# EAGLE design K3NG Rotator Interface V2 (EAGLE 9.6.2)
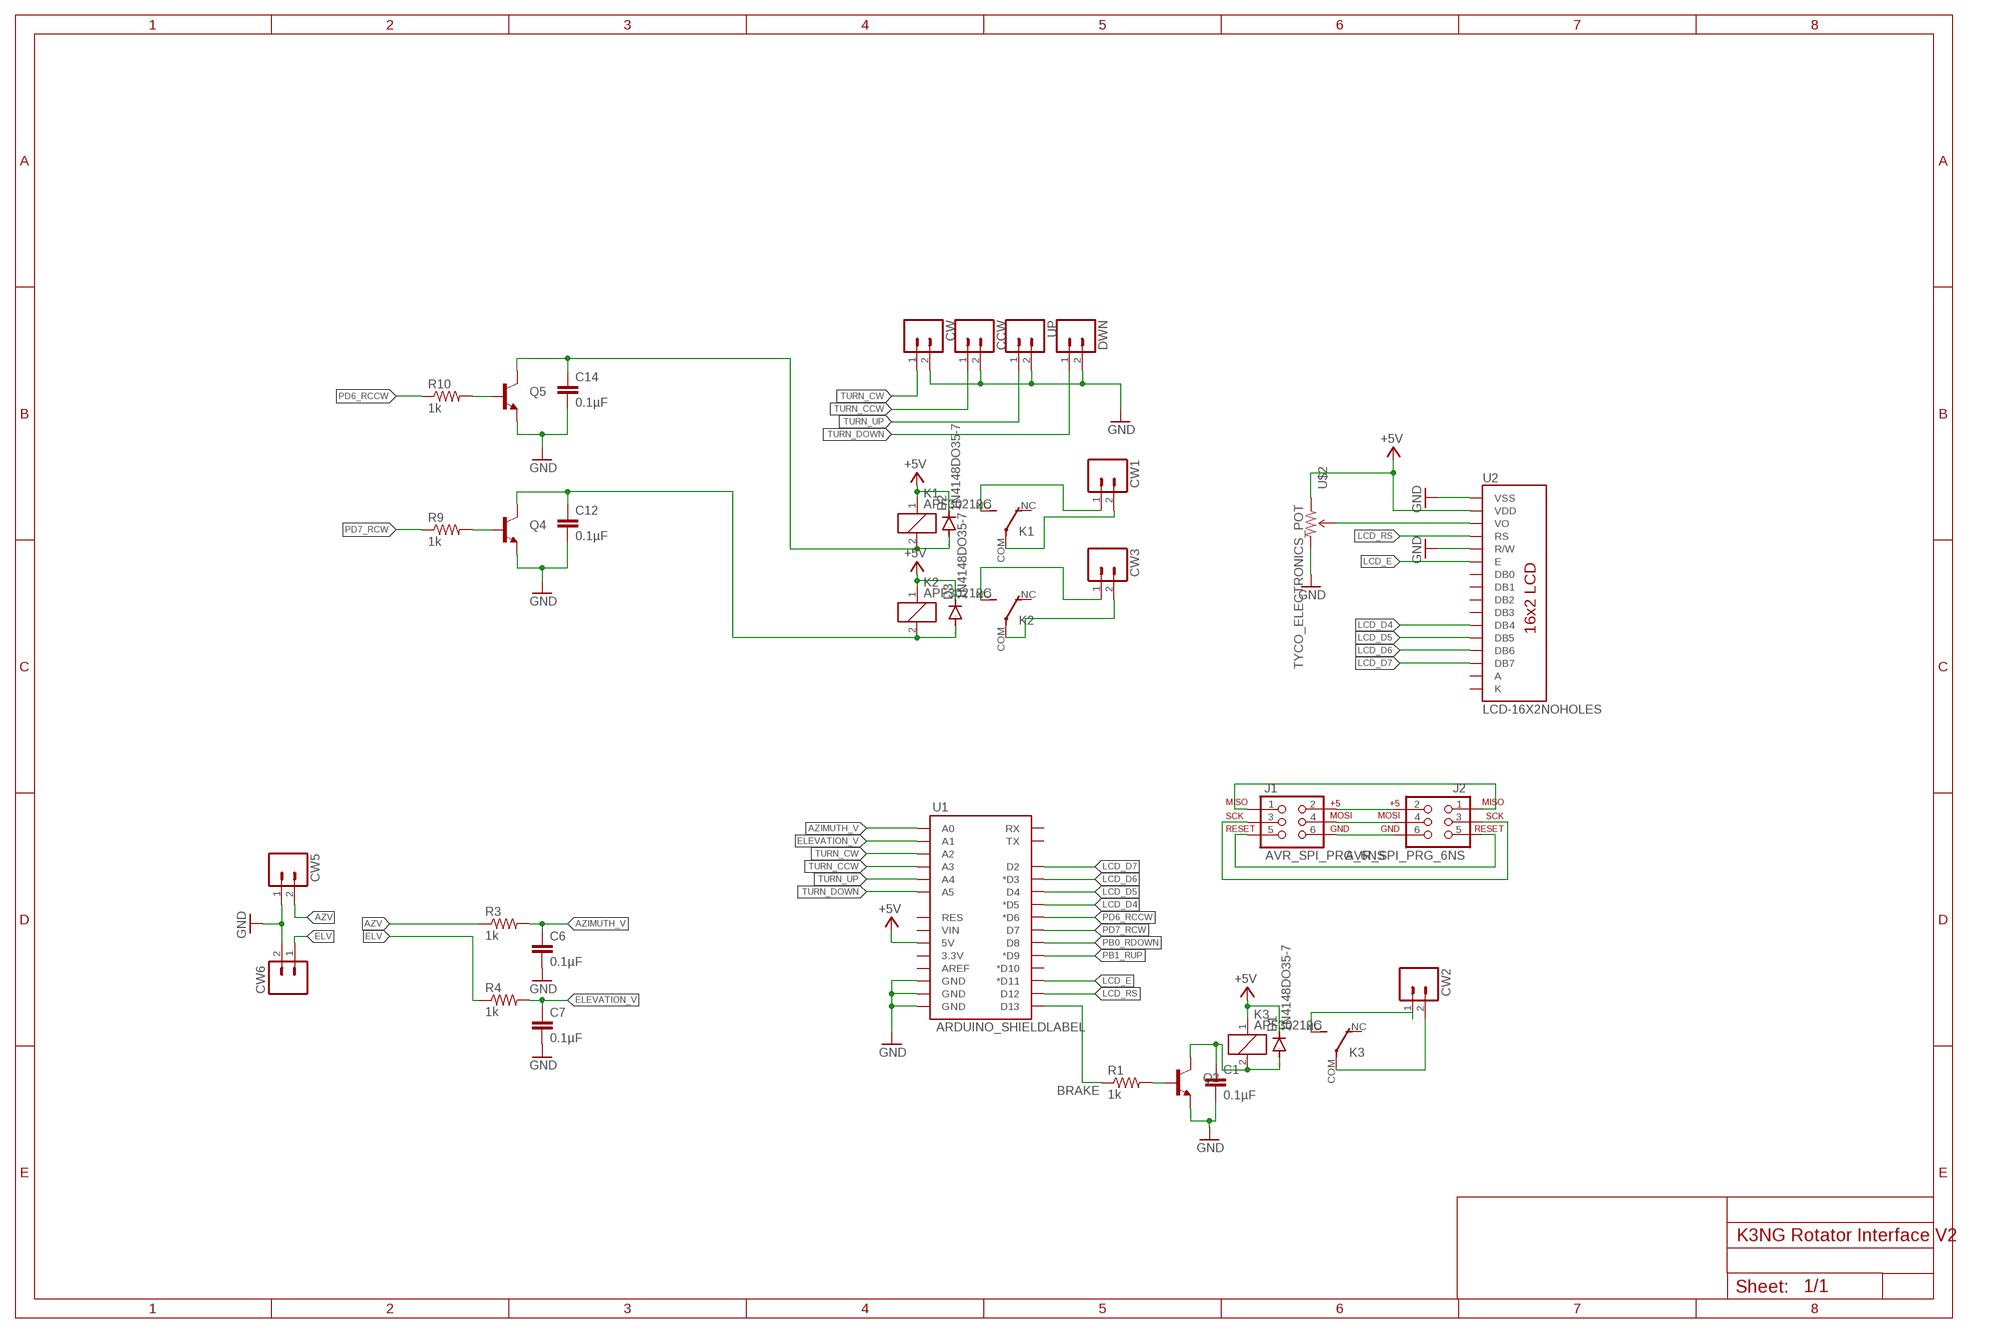
[diagram p0: schematic, sheet 1]

## Parts
C1  0.1µF  CAP0603-CAP  [0603-CAP]
C6  0.1µF  CAP0603-CAP  [0603-CAP]
C7  0.1µF  CAP0603-CAP  [0603-CAP]
C12  0.1µF  CAP0603-CAP  [0603-CAP]
C14  0.1µF  CAP0603-CAP  [0603-CAP]
CCW  M02PTH  [1X02]
CW  M02PTH  [1X02]
CW1  M02PTH  [1X02]
CW2  M02PTH  [1X02]
CW3  M02PTH  [1X02]
CW5  M02PTH  [1X02]
CW6  M02PTH  [1X02]
D1  1N4148DO35-7  [DO35-7]
D2  1N4148DO35-7  [DO35-7]
D3  1N4148DO35-7  [DO35-7]
DWN  M02PTH  [1X02]
J1  AVR_SPI_PRG_6NS  [2X3-NS]
J2  AVR_SPI_PRG_6NS  [2X3-NS]
K1  APF30212C  [APF30212C]
K2  APF30212C  [APF30212C]
K3  APF30212C  [APF30212C]
Q2  TRANSISTOR_NPNSOT23  [SOT23]
Q4  TRANSISTOR_NPNSOT23  [SOT23]
Q5  TRANSISTOR_NPNSOT23  [SOT23]
R1  1k  RESISTOR0805-RES  [0805]
R3  1k  RESISTOR0805-RES  [0805]
R4  1k  RESISTOR0805-RES  [0805]
R9  1k  RESISTOR0805-RES  [0805]
R10  1k  RESISTOR0805-RES  [0805]
U1  ARDUINO_SHIELDLABEL  [DUEMILANOVE_SHIELD]
U2  LCD-16X2NOHOLES  [LCD-16X2_NOHOLES]
U$2  TYCO_ELECTRONICS_POT  [TYCO_ELECTRONICS_POT]
UP  M02PTH  [1X02]

## Nets
+5V [usbvcc]: D1.C D2.C D3.C K1.1 K2.1 K3.1 U1.5V U2.2(VDD) U$2.P$1(CCW)
AZIMUTH_V: C6.1 R3.2 U1.A0
AZV: CW5.2 R3.1
BRAKE: R1.1 U1.D13
ELEVATION_V: C7.1 R4.2 U1.A1
ELV: CW6.1 R4.1
GND [gnd]: C1.2 C6.2 C7.2 C12.2 C14.2 CCW.2 CW5.1 CW6.2 CW.2 DWN.2 Q2.2(E) Q4.2(E) Q5.2(E) U1.GND@0(GND) U1.GND@1(GND) U1.GND@2(GND) U2.1(VSS) U2.5(R/W) U$2.P$3(CW) UP.2
LCD_D4: U1.D5(*D5) U2.11(DB4)
LCD_D5: U1.D4 U2.12(DB5)
LCD_D6: U1.D3(*D3) U2.13(DB6)
LCD_D7: U1.D2 U2.14(DB7)
LCD_E: U1.D11(*D11) U2.6(E)
LCD_RS: U1.D12 U2.4(RS)
N$1: J1.2 J2.2
N$2: J1.4 J2.4
N$3: J1.6 J2.6
N$4: J1.1 J2.1
N$5: J1.5 J2.5
N$6: J1.3 J2.3
N$7: CW2.2 K3.COM(2:P)
N$10: CW2.1 K3.NO(2:S)
N$11: CW1.1 K1.NO(2:S)
N$13: CW3.1 K2.NO(2:S)
N$15: Q2.1(B) R1.2
N$17: U2.3(VO) U$2.P$2(WIPER)
N$18: C1.1 D1.A K3.2 Q2.3(C)
N$19: Q4.1(B) R9.2
N$21: CW3.2 K2.COM(2:P)
N$22: Q5.1(B) R10.2
N$23: CW1.2 K1.COM(2:P)
PB0_RDOWN: U1.D8
PB1_RUP: U1.D9(*D9)
PD6_RCCW: R10.1 U1.D6(*D6)
PD7_RCW: R9.1 U1.D7
ROTATE_CCW: C14.1 D2.A K1.2 Q5.3(C)
ROTATE_CW: C12.1 D3.A K2.2 Q4.3(C)
TURN_CCW: CCW.1 U1.A3
TURN_CW: CW.1 U1.A2
TURN_DOWN: DWN.1 U1.A5
TURN_UP: U1.A4 UP.1
Unconnected: K1.NC(2:O) K2.NC(2:O) K3.NC(2:O) U1.3.3V U1.AREF U1.D10(*D10) U1.RES U1.RX U1.TX U1.VIN U2.7(DB0) U2.8(DB1) U2.9(DB2) U2.10(DB3)

## Power pins joined to a net without a drawn wire
A: U2.15(A)
K: U2.16(K)

## Library data of the parts
C1 C6 C7 C12 C14 = SparkFun:CAP: Capacitor Standard 0603 ceramic capacitor, and 0.1" leaded capacitor.
CCW CW CW1-CW3 CW5 CW6 DWN UP = SparkFun:M02: Header 2 Standard 2-pin 0.1" header. Use with straight break away headers (SKU : PRT-00116), right angle break away headers (PRT-00553), swiss pins (PRT-00743), machine pins (PRT-00117), and female headers (PRT-00115). Molex polarized connector foot print use with SKU : PRT-08233 with associated crimp pins and housings.
D1-D3 = diode:1N4148: DIODE high speed (Philips)
J1 J2 = SparkFun:AVR_SPI_PRG_6: AVR ISP 6 Pin This is the reduced ISP connector for AVR programming. Common on Arduino. This footprint will take up less PCB space and can be used with a 10-pin to 6-pin adapter such as SKU: BOB-08508
K1-K3 = relay:APF30212C: Compliant with European standards 1a/1c 6A Slim power relays Source: Data sheet <http://pewa.panasonic.com/assets/pcsd/catalog/pf-catalog.pdf>; OC_FARNELL: unknown
Q2 Q4 Q5 = SparkFun:TRANSISTOR_NPN: Transistor NPN BJT configuration in SOT23 package. MMBT2222 is the common NPN we use. Double check BCE configuration again layout.
R1 R3 R4 R9 R10 = SparkFun:RESISTOR: Resistor Basic schematic elements and footprints for 0603, 1206, and PTH resistors.
U1 = SparkFun:ARDUINO_SHIELD
U2 = SparkFun:LCD-16X2
U$2 = Ava:TYCO_ELECTRONICS_POT

## Net classes
0 default: width 0.254 mm, drill 0.305 mm, clearance 0.152 mm
2 gnd: width 0.305 mm, drill 0.508 mm, clearance 0.152 mm
3 usbvcc: width 0.508 mm, drill 0.508 mm, clearance 0.152 mm
4 aref: width 0.406 mm

## Board
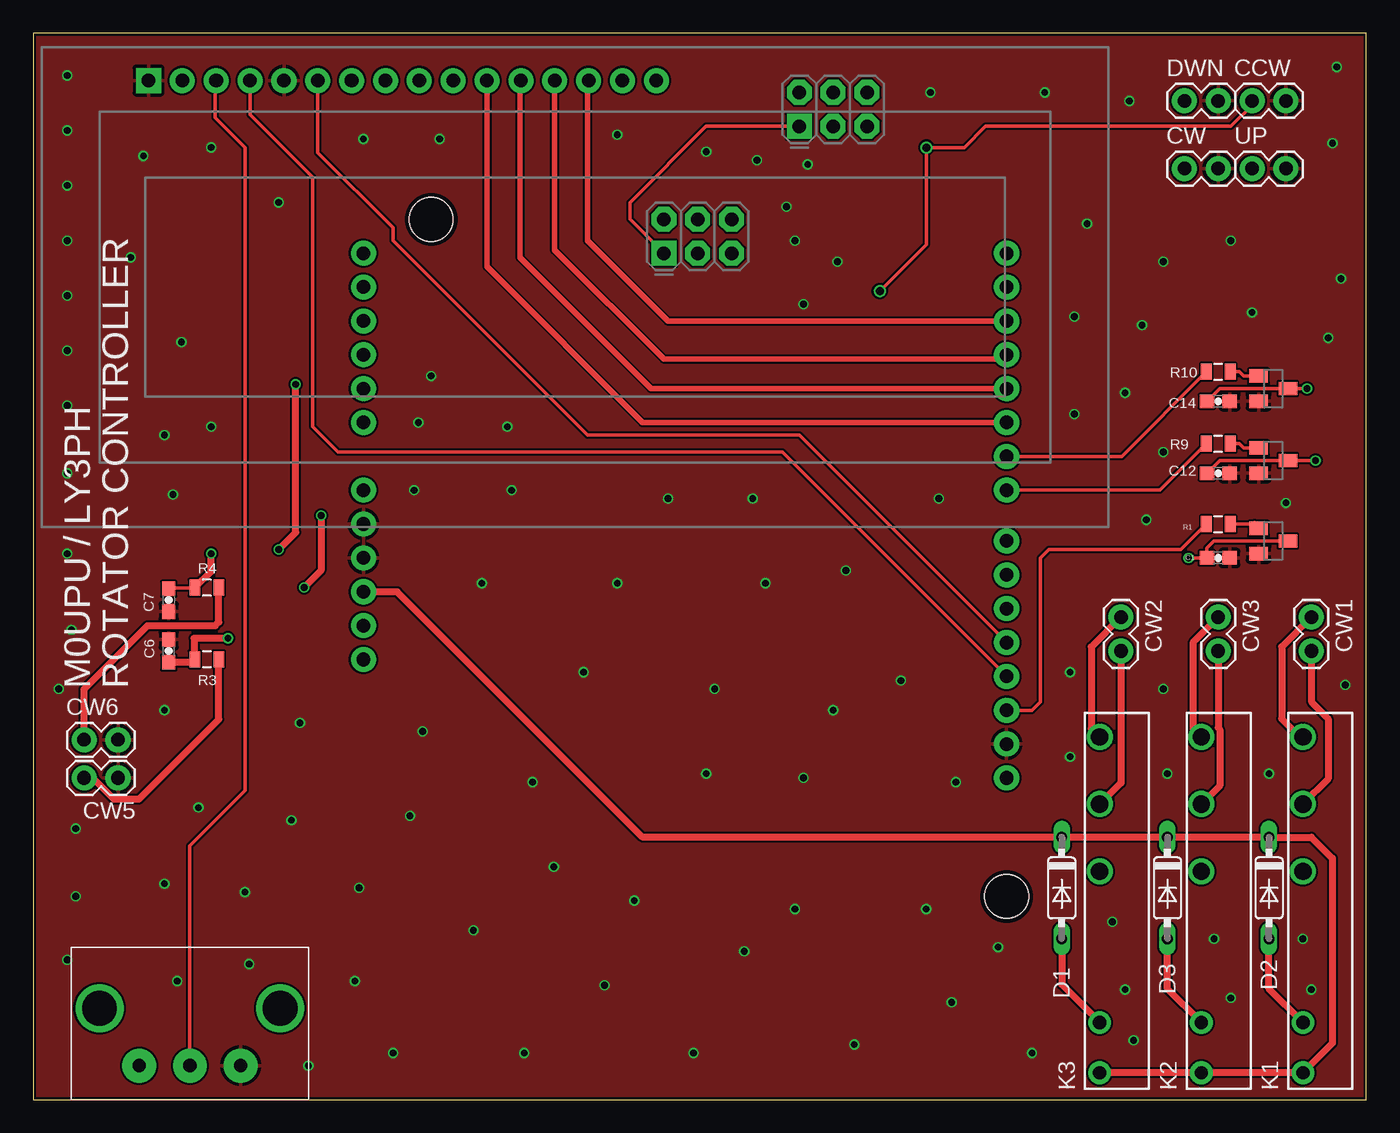
[diagram p1: board, top side]
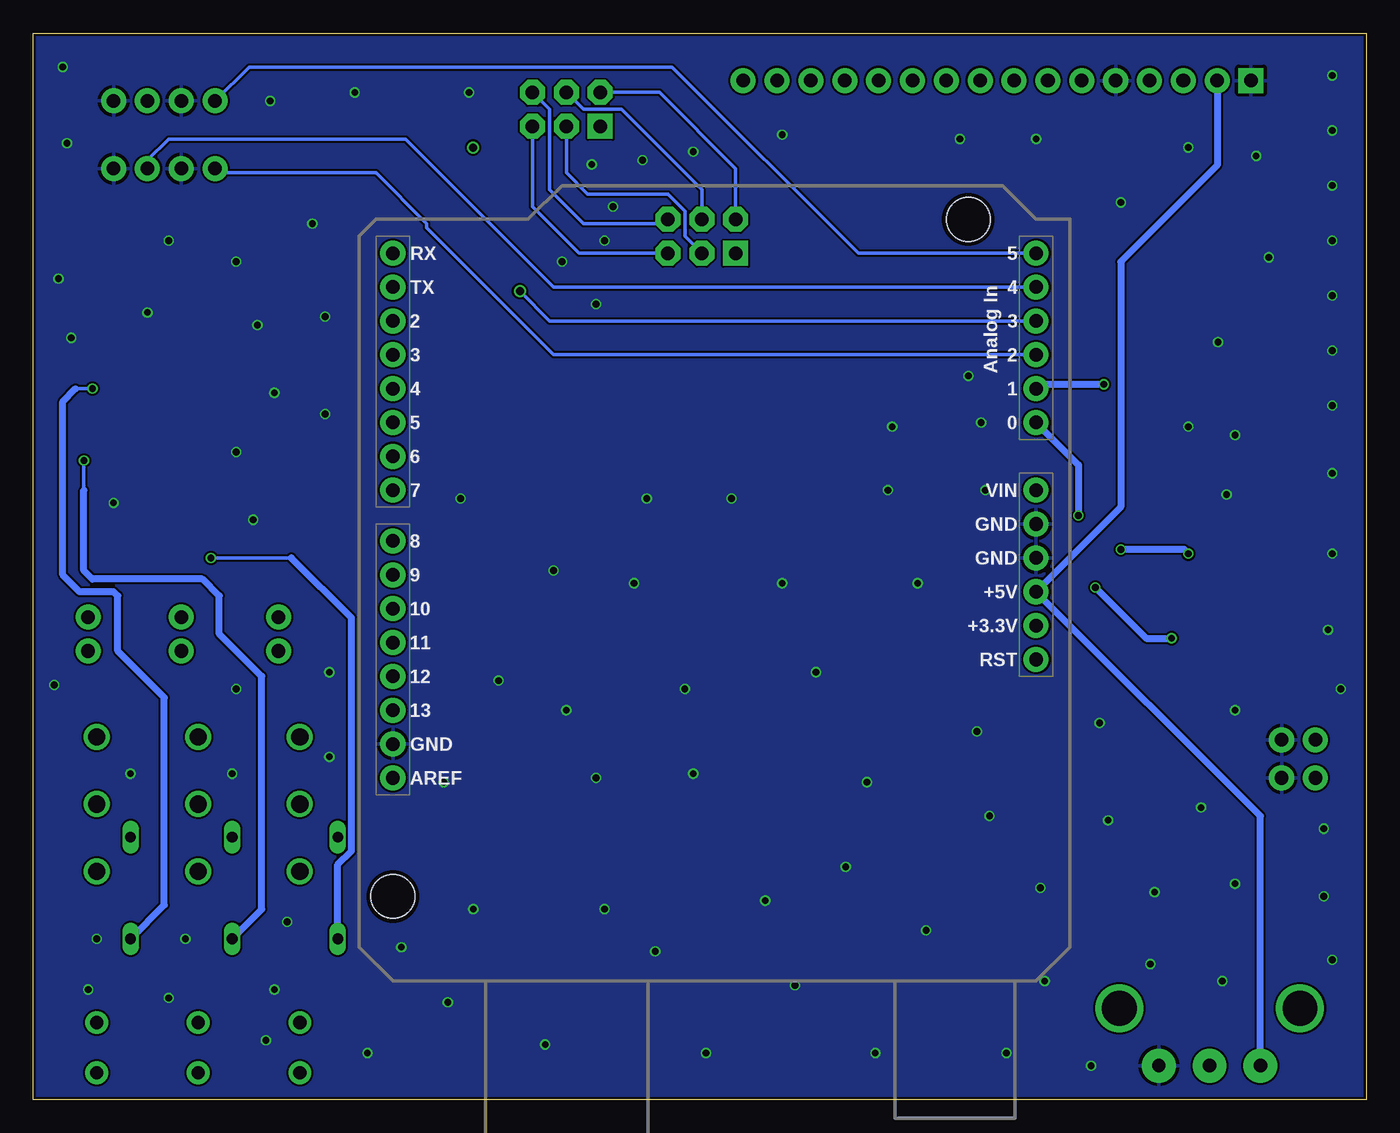
[diagram p2: board, bottom side, seen from below]

Size 100 x 80 mm. Coordinates in mm from the lower left corner, seen from the top.
Outline: 0,0 100,0 100,80 0,80 0,0
Copper layers (1*16): Top 0.035559375mm / dielectric 1.6mm / Bottom 0.035559375mm
Design rules "jlcpcb-2layers *": minimum track width 5mil, minimum drill 12mil, track to track 5mil, track to pad 5mil, pad to pad 5mil, via to via 5mil, smd to smd 5mil, copper to edge 8mil, drill to drill 6mil, minimum pad ring 5mil, minimum via ring 3mil, stop-mask expansion 2.5mil, vias tented up to drill 15mil, thermal gap 10mil

### Footprints (pad centres in the part's own frame; a part is rotated, then mirrored left to right if it is on the bottom)
0603-CAP = smd 1.1 x 1: 1 -0.85,0; 2 0.85,0
1X02 = drill 1.016 pad 1.88: 1 0,0; 2 2.54,0
DO35-7 = drill 0.813 long: A 3.81,0; C -3.81,0
2X3-NS = drill 1.016 pad 1.88 square: 1 -2.54,-1.27 | drill 1.016 pad 1.88 octagon: 2 -2.54,1.27; 3 0,-1.27; 4 0,1.27; 5 2.54,-1.27; 6 2.54,1.27
APF30212C = drill 1 pad 1.7: 1 -12.6,0; 2 -8.82,0 | drill 1.3 pad 1.9: COM 7.56,0; NC 2.52,0; NO 12.6,0
SOT23 = smd 1 x 1.4: 1 -0.95,-1.1; 2 0.95,-1.1; 3 0,1.1
0805 = smd 0.8 x 1.2: 1 -0.9,0; 2 0.9,0
DUEMILANOVE_SHIELD = drill 1.016 pad 1.88: 3.3V 50.8,26.67; 5V 50.8,29.21; A0 50.8,41.91; A1 50.8,44.45; A2 50.8,46.99; A3 50.8,49.53; A4 50.8,52.07; A5 50.8,54.61; AREF 2.54,15.24; D2 2.54,49.53; D3 2.54,46.99; D4 2.54,44.45; D5 2.54,41.91; D6 2.54,39.37; D7 2.54,36.83; D8 2.54,33.02; D9 2.54,30.48; D10 2.54,27.94; D11 2.54,25.4; D12 2.54,22.86; D13 2.54,20.32; GND@0 50.8,31.75; GND@1 50.8,34.29; GND@2 2.54,17.78; RES 50.8,24.13; RX 2.54,54.61; TX 2.54,52.07; VIN 50.8,36.83 | hole 3.302: 45.72,57.15; 2.54,6.35
LCD-16X2_NOHOLES = drill 1.016 pad 1.88 square: 1 -32,15.5 | drill 1.016 pad 1.88: 2 -29.46,15.5; 3 -26.92,15.5; 4 -24.38,15.5; 5 -21.84,15.5; 6 -19.3,15.5; 7 -16.76,15.5; 8 -14.22,15.5; 9 -11.68,15.5; 10 -9.14,15.5; 11 -6.6,15.5; 12 -4.06,15.5; 13 -1.52,15.5; 14 1.02,15.5; 15 3.56,15.5; 16 6.1,15.5
TYCO_ELECTRONICS_POT = drill 1 pad 2.54: P$1 -3.81,0; P$2 0,0; P$3 3.81,0 | drill 2.6: P$4 -6.775,4.3; P$5 6.775,4.3

### Placement (x,y rotation side)
C1  88.9,40.64 0 top
C6  10.16,33.66 90 top
C7  10.16,37.47 270 top
C12  88.9,46.99 0 top
C14  88.9,52.39 0 top
CCW  91.44,74.93 0 top
CW  86.36,69.85 0 top
CW1  95.89,36.2 270 top
CW2  81.6,36.2 270 top
CW3  88.9,36.2 270 top
CW5  6.35,24.13 180 top
CW6  3.81,26.99 0 top
D1  77.15,15.88 270 top
D2  92.71,15.88 270 top
D3  85.09,15.88 270 top
DWN  86.36,74.93 0 top
J1  49.85,64.77 0 top
J2  60.01,74.3 0 top
K1  95.25,14.61 90 top
K2  87.63,14.61 90 top
K3  80.01,14.61 90 top
Q2  93.03,41.91 270 top
Q4  93.03,47.94 270 top
Q5  93.03,53.34 270 top
R1  88.9,43.18 0 top
R3  13.02,33.02 180 top
R4  13.02,38.42 180 top
R9  88.9,49.21 0 top
R10  88.9,54.61 0 top
U1  75.56,8.89 0 bottom
U2  40.64,60.96 0 top
U$2  11.75,2.54 0 top
UP  91.44,69.85 0 top

### Tracks (layer width: path | path; a pad name or v marks a point on that pad's centre or on a via)
+5V
  Top 0.508: K3.1 K2.1 K1.1 97.47,4.23 97.47,18.1 95.89,19.68 D2.C D3.C D1.C 45.72,19.68 27.3,38.1 U1.5V
  Bottom 0.508: U2.2 11.18,70.1 18.41,62.87 18.41,44.45 U1.5V 7.94,21.27 U$2.P$1
AZIMUTH_V  (via drill 0.51)
  Top 0.508: C6.1 11.9,32.8 R3.2 12.06,33.07 12.06,34.61 v14.61,34.61 | v21.59,43.81 21.59,39.69 v20.32,38.42
  Bottom 0.508: U1.A0 21.59,47.62 v21.59,43.81 | v20.32,38.42 16.51,34.61 v14.61,34.61
AZV
  Top 0.508: CW5.2 4.45,24.13 6.03,22.54 7.94,22.54 13.92,28.52 R3.1
BRAKE
  Top 0.254: R1.1 86.09,41.27 76.2,41.27 75.56,40.64 75.56,29.84 74.93,29.21 U1.D13
ELEVATION_V  (via drill 0.51)
  Top 0.254: C7.1 10.21,38.37 12.07,38.37 R4.2
  Top 0.508: R4.2 13.34,39.63 v13.34,40.96 | v18.41,41.27 19.68,42.55 v19.68,53.66
  Bottom 0.508: v13.34,40.96 13.65,41.27 v18.41,41.27 | v19.68,53.66 24.45,53.66 U1.A1
ELV
  Top 0.508: CW6.1 3.81,30.8 8.57,35.56 13.65,35.56 13.92,35.83 R4.1
GND  (via drill 0.51)
  other vias: 2.54,76.83 2.54,72.71 2.54,68.58 2.54,64.45 2.54,60.33 2.54,56.2 2.54,52.07 2.54,46.99 2.54,40.96 2.86,35.24 1.91,30.8 3.17,20.32 3.17,15.24 2.54,10.48 10.79,8.89 16.19,10.16 15.88,15.56 9.84,16.19 12.38,21.91 9.84,29.21 19.37,20.95 20,28.26 29.21,27.62 37.47,23.81 28.26,21.27 24.45,15.88 24.13,8.89 26.99,3.49 20.64,2.54 36.83,3.49 33.02,12.7 45.09,14.92 57.15,14.29 66.99,14.29 68.9,7.3 61.59,4.13 49.53,3.49 42.86,8.57 39.05,17.46 74.93,3.49 69.22,23.81 65.09,31.43 33.66,38.73 43.81,38.73 54.93,38.73 60.01,29.21 57.78,24.13 50.48,24.45 51.12,30.8 41.27,32.07 53.34,11.11 60.96,39.69 53.98,45.09 35.88,45.72 28.57,45.72 47.62,45.09 28.89,50.8 35.56,50.48 29.84,54.29 9.84,49.85 11.11,56.83 8.26,70.8 7.3,63.18 10.48,45.4 13.34,50.48 13.34,71.44 18.41,67.31 24.77,72.07 30.48,72.07 43.81,72.39 67.31,75.56 75.88,75.56 79.06,65.72 78.11,58.74 78.11,51.44 67.94,45.09 82.23,74.93 97.79,77.47 97.47,71.75 98.11,61.59 89.85,64.45 84.77,62.87 83.19,58.1 91.44,59.05 97.16,57.15 81.92,53.02 84.77,48.58 83.5,43.5 93.98,44.77 98.42,31.11 84.77,30.8 77.79,32.07 77.79,25.72 92.71,24.45 85.09,24.45 88.58,12.06 95.25,12.06 89.85,7.62 95.89,8.26 80.96,13.34 81.92,8.26 82.55,4.45 72.39,11.43 60.33,62.87 57.78,59.69 57.15,64.45 56.52,66.99 58.1,70.17 54.29,70.48 50.48,71.12
  pour Bottom: 0,81.28 101.6,81.28 101.6,0 0,0
  pour Top: 0,81.28 101.6,81.28 101.6,0 0,0
LCD_D4
  Top 0.406: U2.11 34.04,62.48 45.72,50.8 U1.D5
LCD_D5
  Top 0.406: U1.D4 46.35,53.34 36.51,63.18 36.51,76.39 U2.12
LCD_D6
  Top 0.406: U2.13 39.12,63.75 47.31,55.56 72.71,55.56 U1.D3
LCD_D7
  Top 0.406: U1.D2 47.62,58.42 41.59,64.45 41.59,76.39 U2.14
LCD_E
  Top 0.254: U2.6 21.34,71.05 26.99,65.41 26.99,64.45 41.59,49.85 57.47,49.85 U1.D11
LCD_RS
  Top 0.254: U2.4 16.26,73.91 20.95,69.22 20.95,50.48 22.86,48.58 56.2,48.58 U1.D12
N$1
  Bottom 0.254: J2.2 53.02,75.56 47.31,69.85 J1.2
N$2
  Bottom 0.254: J2.4 58.74,74.3 55.88,74.3 49.85,68.26 J1.4
N$3
  Bottom 0.254: J2.6 61.28,74.3 61.28,68.26 58.74,65.72 52.7,65.72 J1.6
N$4
  Top 0.254: J2.1 50.48,73.03 44.77,67.31 44.77,66.04 J1.1
N$5
  Bottom 0.254: J1.5 59.05,63.5 62.55,66.99 J2.5
N$6
  Bottom 0.254: J2.3 60.01,69.53 58.42,67.94 52.39,67.94 51.12,66.67 51.12,64.77 J1.3
N$7
  Top 0.508: CW2.2 81.6,23.75 K3.COM
N$10
  Top 0.508: CW2.1 79.38,33.97 79.38,27.84 K3.NO
N$11
  Top 0.508: CW1.1 93.66,33.97 93.66,28.57 95.03,27.2 K1.NO
N$13
  Top 0.508: CW3.1 87,34.29 87,27.84 K2.NO
N$15
  Top 0.254: R1.2 91.61,43.18
  Top 0.508: 91.61,43.18 Q2.1
N$17
  Top 0.254: U$2.P$2 11.75,19.05 15.88,23.18 15.88,71.44 13.65,73.66 13.65,76.39 U2.3
N$18  (via drill 0.51)
  Top 0.254: Q2.3 88.58,41.91 88.05,41.38 C1.1 v86.68,40.64
  Top 0.508: D1.A 77.15,8.64 K3.2
  Bottom 0.254: 80.64,40.64 v86.68,40.64
  Bottom 0.508: D1.A 77.15,17.64 76.14,18.66 76.14,36.13 80.64,40.64
N$19
  Top 0.254: R9.2 90.49,49.21 90.81,48.9 Q4.1
N$21
  Top 0.508: CW3.2 88.9,27.89 89.01,27.78 89.01,23.55 K2.COM
N$22
  Top 0.254: R10.2 90.49,54.61 90.81,54.29 Q5.1
N$23
  Top 0.508: CW1.2 95.89,29.84 97.16,28.57 97.16,24.07 K1.COM
PD6_RCCW
  Top 0.254: R10.1 81.65,48.26 U1.D6
PD7_RCW
  Top 0.254: R9.1 84.51,45.72 U1.D7
ROTATE_CCW  (via drill 0.51)
  Top 0.254: C14.1 89,53.34 Q5.3 v95.57,53.34
  Top 0.508: K1.2 92.71,8.32 D2.A
  Bottom 0.254: 96.84,53.34 v95.57,53.34
  Bottom 0.508: D2.A 90.17,14.61 90.17,30.16 93.66,33.66 93.66,37.78 93.98,38.1 96.52,38.1 97.79,39.37 97.79,52.39 96.84,53.34
ROTATE_CW  (via drill 0.51)
  Top 0.254: C12.1 89,47.94 Q4.3 v96.2,47.94
  Top 0.508: K2.2 85.09,8.32 D3.A
  Bottom 0.254: 96.2,45.72 v96.2,47.94
  Bottom 0.508: D3.A 82.87,14.29 82.87,31.75 86.04,34.92 86.04,37.78 87.31,39.05 95.57,39.05 96.2,39.69 96.2,45.72
TURN_CCW  (via drill 0.6)
  Top 0.254: v63.5,60.64 66.99,64.14 v66.99,71.44 69.85,71.44 71.44,73.03 89.85,73.03 91.44,74.61 CCW.1
  Bottom 0.254: v63.5,60.64 61.28,58.42 U1.A3
TURN_CW
  Bottom 0.254: U1.A2 60.96,55.88 70.48,65.41 70.48,65.72 74.3,69.53 86.04,69.53 CW.1
TURN_DOWN
  Bottom 0.254: U1.A5 38.1,63.5 52.07,77.47 83.82,77.47 DWN.1
TURN_UP
  Bottom 0.254: UP.1 91.44,70.48 89.85,72.07 72.07,72.07 60.96,60.96 U1.A4

### Text on the board
tPlace: M0UPU / LY3PH | ROTATOR CONTROLLER